# Altium schematic sheet Sheet1.SchDoc (part 1 of 2)
size A2; SheetNumber: 1; SheetTotal: 1
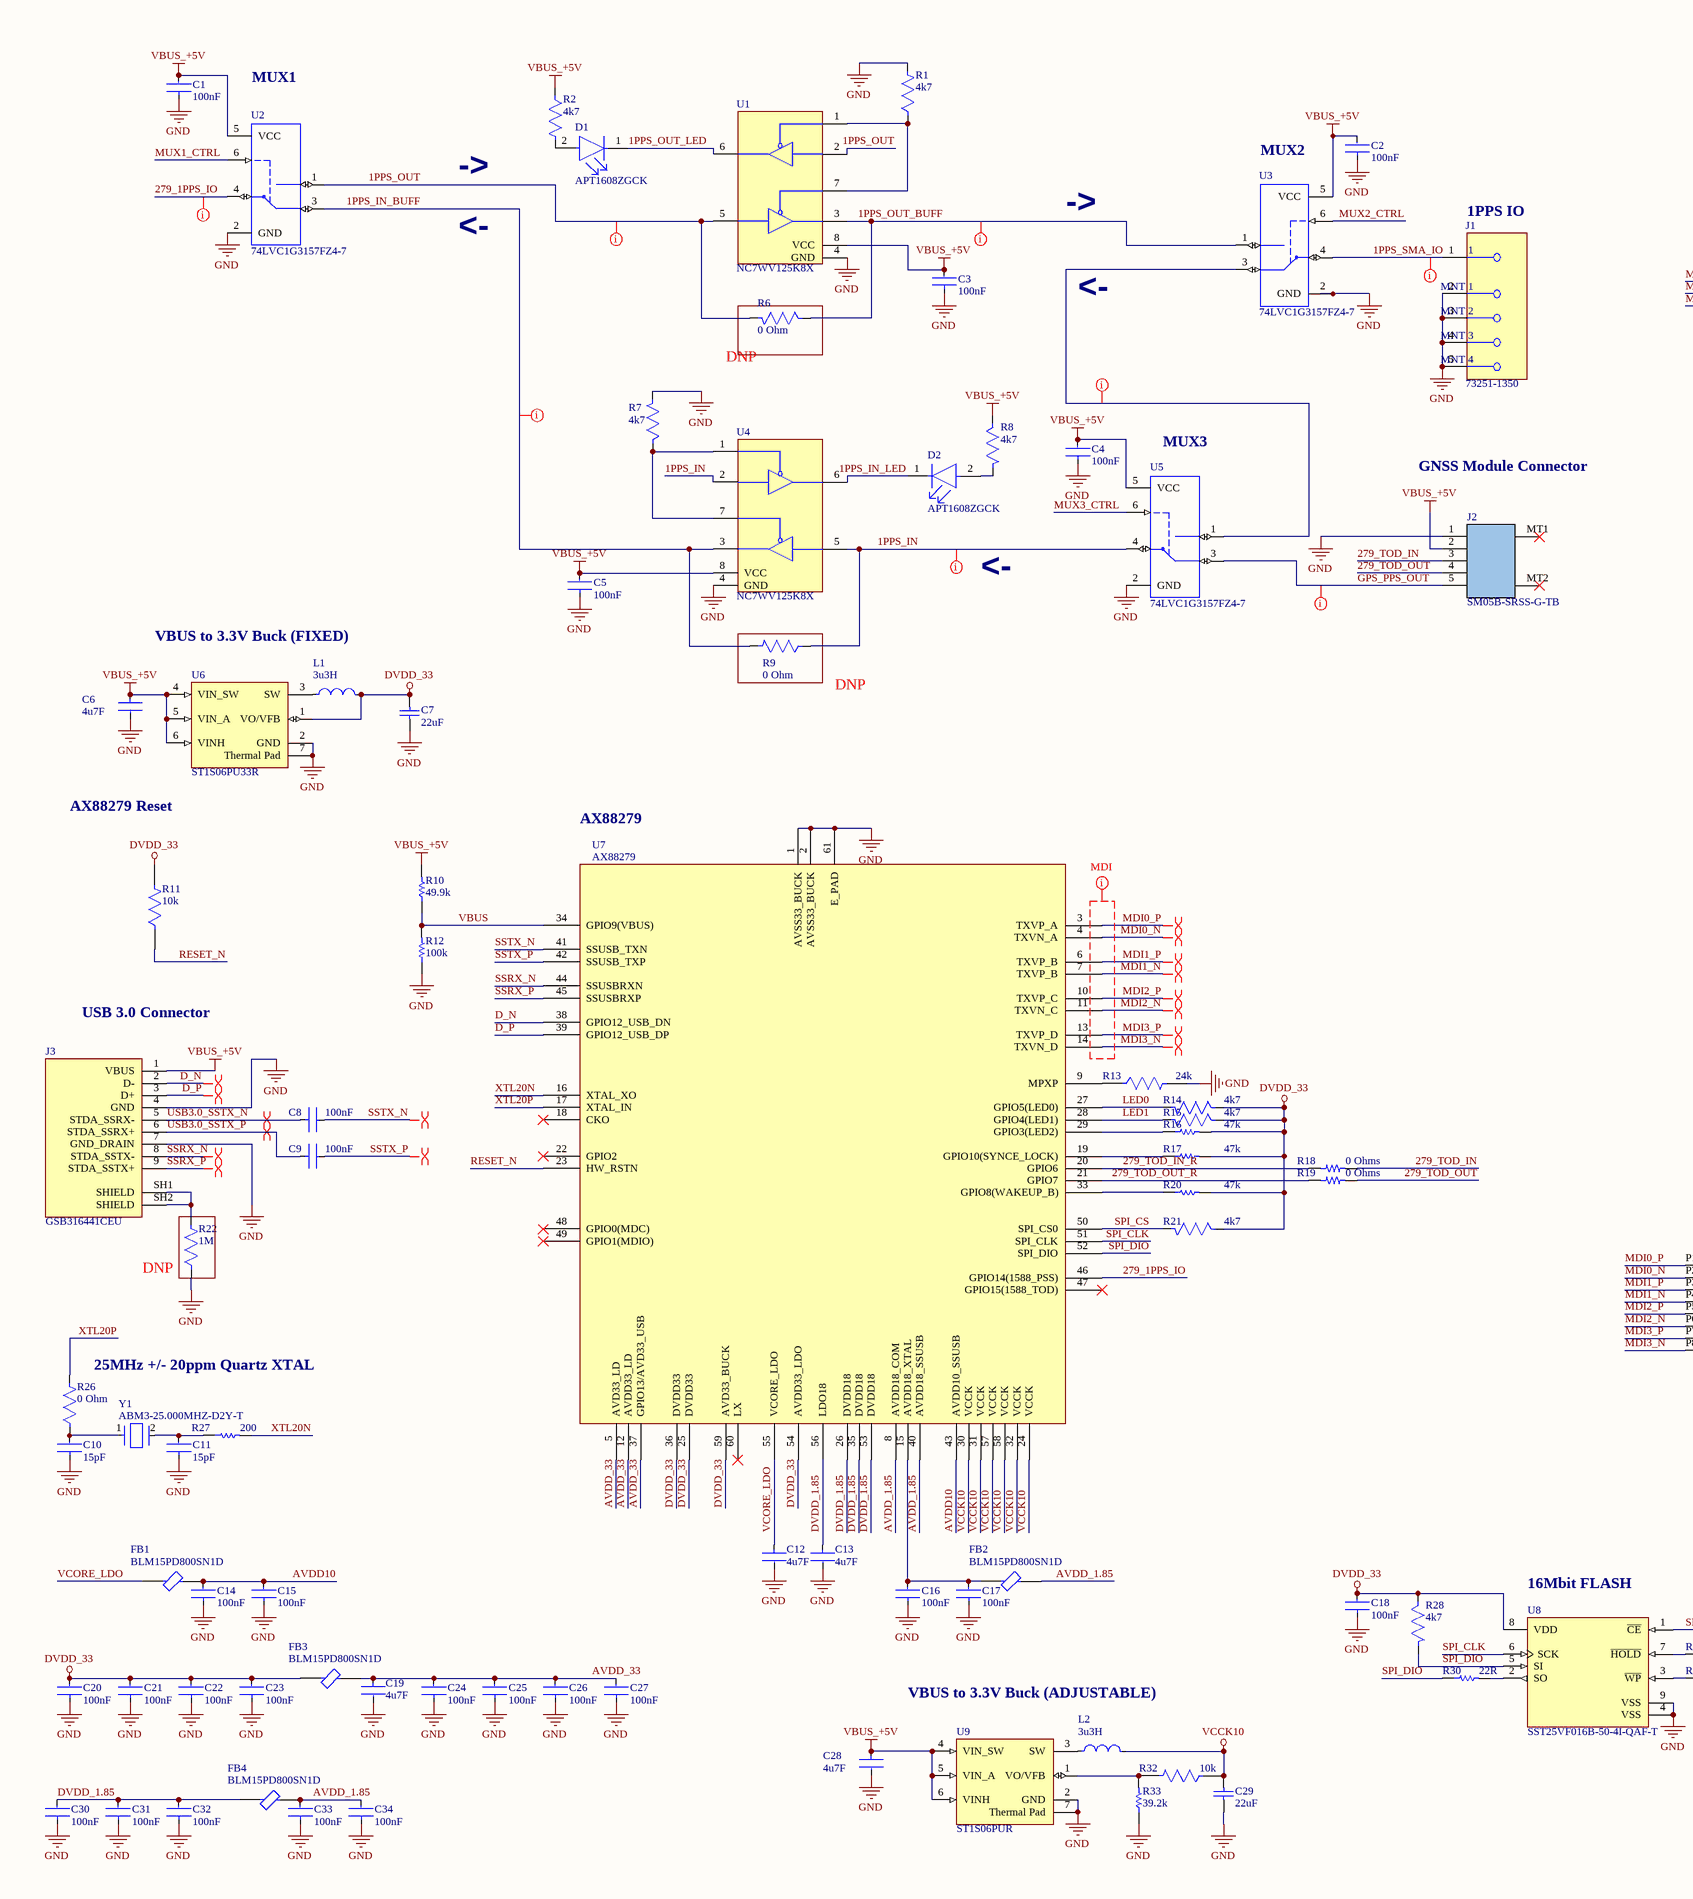
[diagram p0: Sheet1.SchDoc, left]
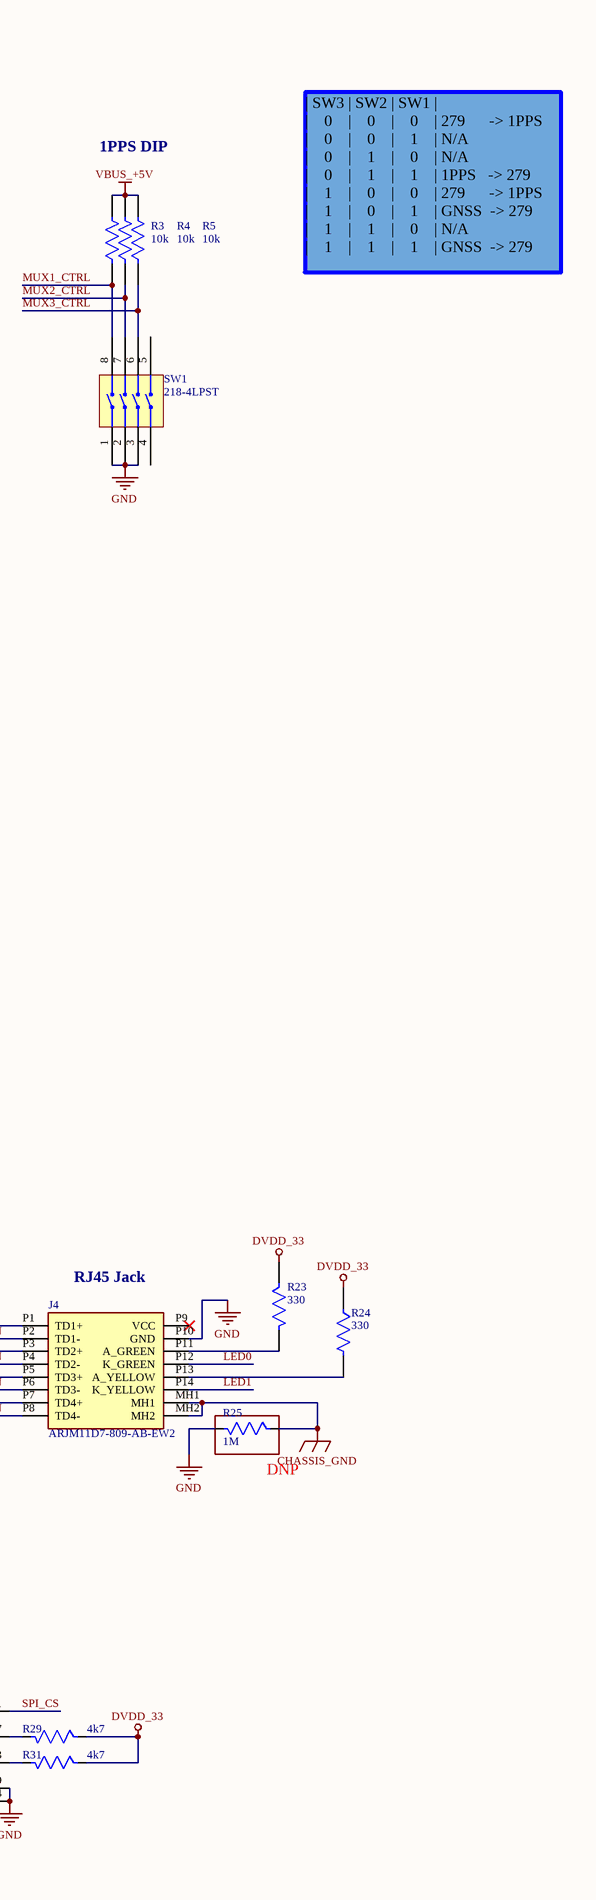
[diagram p1: Sheet1.SchDoc, right]

## Parts
C1  100nF  [FP-CL251-IPC_C]
C2  100nF  [FP-CL251-IPC_C]
C3  100nF  [FP-CL251-IPC_C]
C4  100nF  [FP-CL251-IPC_C]
C5  100nF  [FP-CL251-IPC_C]
C6  4u7F  [FP-0402-L_1_0_0_15-W_0_5-IPC_C]
C7  22uF  [CAPC1608X100X20ML10]
C8  100nF  [FP-CL251-IPC_C]
C9  100nF  [FP-CL251-IPC_C]
C10  15pF  [FP-CBR04C-MFG]
C11  15pF  [FP-CBR04C-MFG]
C12  4u7F  [FP-0402-L_1_0_0_15-W_0_5-IPC_C]
C13  4u7F  [FP-0402-L_1_0_0_15-W_0_5-IPC_C]
C14  100nF  [FP-CL251-IPC_C]
C15  100nF  [FP-CL251-IPC_C]
C16  100nF  [FP-CL251-IPC_C]
C17  100nF  [FP-CL251-IPC_C]
C18  100nF  [FP-CL251-IPC_C]
C19  4u7F  [FP-0402-L_1_0_0_15-W_0_5-IPC_C]
C20  100nF  [FP-CL251-IPC_C]
C21  100nF  [FP-CL251-IPC_C]
C22  100nF  [FP-CL251-IPC_C]
C23  100nF  [FP-CL251-IPC_C]
C24  100nF  [FP-CL251-IPC_C]
C25  100nF  [FP-CL251-IPC_C]
C26  100nF  [FP-CL251-IPC_C]
C27  100nF  [FP-CL251-IPC_C]
C28  4u7F  [FP-0402-L_1_0_0_15-W_0_5-IPC_C]
C29  22uF  [CAPC1608X100X20ML10]
C30  100nF  [FP-CL251-IPC_C]
C31  100nF  [FP-CL251-IPC_C]
C32  100nF  [FP-CL251-IPC_C]
C33  100nF  [FP-CL251-IPC_C]
C34  100nF  [FP-CL251-IPC_C]
D1  APT1608ZGCK  [FP-APT1608ZGCK-MFG]
D2  APT1608ZGCK  [FP-APT1608ZGCK-MFG]
FB1  BLM15PD800SN1D  [FP-BLM15-0_05-MFG]
FB2  BLM15PD800SN1D  [FP-BLM15-0_05-MFG]
FB3  BLM15PD800SN1D  [FP-BLM15-0_05-MFG]
FB4  BLM15PD800SN1D  [FP-BLM15-0_05-MFG]
J1  73251-1350  [FP-73251-1350-MFG]
J2  Manufacturer Part Number: SM05B-SRSS-G-TB  [JST_SM05B-SRSS-TB_REV_NOV_29_2010]  (hidden comment: JST_SM05B-SRSS-G-TB)
J3  GSB316441CEU  [CONN_AMPHENOL_GSB316441CEU]
J4  ARJM11D7-809-AB-EW2  [ARJM11D7809ABEW2]
L1  3u3H  [FP-LQM2HPN_G0-IPC_A]
L2  3u3H  [FP-LQM2HPN_G0-IPC_A]
R1  4k7  [FP-RT0402-MFG]
R2  4k7  [FP-RT0402-MFG]
R3  10k  [FP-RMCF0402-IPC_C]
R4  10k  [FP-RMCF0402-IPC_C]
R5  10k  [FP-RMCF0402-IPC_C]
R6  0 Ohm  [FP-CR0402-IPC_B]  (no BOM)
R7  4k7  [FP-RT0402-MFG]
R8  4k7  [FP-RT0402-MFG]
R9  0 Ohm  [FP-CR0402-IPC_B]  (no BOM)
R10  49.9k  [RESC1005X40X25LL10T10]
R11  10k  [FP-RMCF0402-IPC_C]
R12  100k  [RESC1005X40X25ML05T05]
R13  24k  [FP-RT0402-MFG]
R14  4k7  [FP-RT0402-MFG]
R15  4k7  [FP-RT0402-MFG]
R16  47k  [RESC1005X40X25LL10T10]
R17  47k  [RESC1005X40X25LL10T10]
R18  0 Ohms  [RES 0402_1005]
R19  0 Ohms  [RES 0402_1005]
R20  47k  [RESC1005X40X25LL10T10]
R21  4k7  [FP-RT0402-MFG]
R22  1M  [FP-RMCF0402-MFG]  (no BOM)
R23  330  [FP-RC1005-IPC_B]
R24  330  [FP-RC1005-IPC_B]
R25  1M  [FP-RMCF0402-MFG]  (no BOM)
R26  0 Ohm  [FP-CR0402-IPC_B]
R27  200  [RESC1005X40X25LL10T10]
R28  4k7  [FP-RT0402-MFG]
R29  4k7  [FP-RT0402-MFG]
R30  22R  [RESC1005X40X25ML05T10]
R31  4k7  [FP-RT0402-MFG]
R32  10k  [FP-RMCF0402-IPC_C]
R33  39.2k  [RESC1005X40X25ML05T10]
SW1  218-4LPST  [CTS 218-4LPJ]
U1  NC7WV125K8X  [SOP50P310X90-8N]
U2  74LVC1G3157FZ4-7  [PSON50P140X100X40-6N]
U3  74LVC1G3157FZ4-7  [PSON50P140X100X40-6N]
U4  NC7WV125K8X  [SOP50P310X90-8N]
U5  74LVC1G3157FZ4-7  [PSON50P140X100X40-6N]
U6  ST1S06PU33R  [DFN6D_L]
U7  AX88279  [IC_AX88279]
U8  SST25VF016B-50-4I-QAF-T  [FP-C04-452-MFG]
U9  ST1S06PUR  [DFN6D_M]
Y1  ABM3-25.000MHZ-D2Y-T  [FP-ABM3-MFG]

## Nets
CHASSIS_GND: J4.MH1 J4.MH2 R25.1
DVDD_33: C7.2 C18.2 C20.2 C21.2 C22.2 C23.2 FB3.1 L1.2 R11.2 R14.1 R15.1 R16.2 R17.2 R20.2 R21.1 R23.1 R24.1 R28.1 R29.1 R31.1 U6.1(VO/VFB) U7.25(DVDD33) U7.36(DVDD33) U7.54(AVDD33_LDO) U7.59(AVD33_BUCK) U8.8(VDD)
GND: C1.1 C2.1 C3.1 C4.1 C5.1 C6.1 C7.1 C10.2 C11.2 C12.1 C13.1 C14.1 C15.1 C16.1 C17.1 C18.1 C19.1 C20.1 C21.1 C22.1 C23.1 C24.1 C25.1 C26.1 C27.1 C28.1 C29.1 C30.1 C31.1 C32.1 C33.1 C34.1 J1.2(MNT_1) J1.3(MNT_2) J1.4(MNT_3) J1.5(MNT_4) J2.1 J3.4(GND) J3.7(GND_DRAIN) J4.P10(GND) R1.2 R7.2 R12.1 R13.2 R22.1 R25.2 R33.1 SW1.1(GND) SW1.2(GND) SW1.3(GND) U1.4(GND) U2.2(GND) U3.2(GND) U4.4(GND) U5.2(GND) U6.2(GND) U6.7(Thermal_Pad) U7.1(AVSS33_BUCK) U7.2(AVSS33_BUCK) U7.61(E_PAD) U8.4(VSS) U8.9(VSS) U9.2(GND) U9.7(Thermal_Pad)
VBUS_+5V: C1.2 C2.2 C3.2 C4.2 C5.2 C6.2 C28.2 J2.2 J3.1(VBUS) R2.1 R3.2 R4.2 R5.2 R8.1 R10.2 U1.8(VCC) U2.5(VCC) U3.5(VCC) U4.8(VCC) U5.5(VCC) U6.4(VIN_SW) U6.5(VIN_A) U6.6(VINH) U9.4(VIN_SW) U9.5(VIN_A) U9.6(VINH)
VCCK10: C29.2 L2.2 R32.1 U7.24(VCCK) U7.30(VCCK) U7.31(VCCK) U7.32(VCCK) U7.57(VCCK) U7.58(VCCK)
1PPS_IN: R9.1 U4.2 U4.5 U5.4(A)
1PPS_IN_BUFF: R9.2 U2.3(B0) U4.3
1PPS_IN_LED: D2.1(C) U4.6
1PPS_OUT: R6.2 U1.2 U1.5 U2.1(B1)
1PPS_OUT_BUFF: R6.1 U1.3 U3.1(B1)
1PPS_OUT_LED: D1.1(C) U1.6
1PPS_SMA_IO: J1.1 U3.4(A)
279_1PPS_IO: U2.4(A) U7.46(GPIO14(1588_PSS))
279_TOD_IN: J2.3 R18.2
279_TOD_IN_R: R18.1 U7.20(GPIO6)
279_TOD_OUT: J2.4 R19.2
279_TOD_OUT_R: R19.1 U7.21(GPIO7)
AVDD10: C14.2 C15.2 FB1.2 U7.43(AVDD10_SSUSB)
AVDD_1.85: C33.2 C34.2 FB2.2 FB4.2 U7.8(AVDD18_COM) U7.40(AVDD18_SSUSB)
AVDD_33: C19.2 C24.2 C25.2 C26.2 C27.2 FB3.2 U7.5(AVD33_LD) U7.12(AVDD33_LD) U7.37(GPIO13/AVD33_USB)
D_N: J3.2(D-) U7.38(GPIO12_USB_DN)
D_P: J3.3(D+) U7.39(GPIO12_USB_DP)
DVDD_1.85: C13.2 C30.2 C31.2 C32.2 FB4.1 U7.26(DVDD18) U7.35(DVDD18) U7.53(DVDD18) U7.56(LDO18)
GPS_PPS_OUT: J2.5 U5.3(B0)
LED0: J4.P12(K_GREEN) R14.2 U7.27(GPIO5(LED0))
LED1: J4.P14(K_YELLOW) R15.2 U7.28(GPIO4(LED1))
MDI0_N: J4.P2(TD1-) U7.4(TXVN_A)
MDI0_P: J4.P1(TD1+) U7.3(TXVP_A)
MDI1_N: J4.P4(TD2-) U7.7(TXVP_B)
MDI1_P: J4.P3(TD2+) U7.6(TXVP_B)
MDI2_N: J4.P6(TD3-) U7.11(TXVN_C)
MDI2_P: J4.P5(TD3+) U7.10(TXVP_C)
MDI3_N: J4.P8(TD4-) U7.14(TXVN_D)
MDI3_P: J4.P7(TD4+) U7.13(TXVP_D)
MUX1_CTRL: R3.1 SW1.8 U2.6(S)
MUX2_CTRL: R4.1 SW1.7 U3.6(S)
MUX3_CTRL: R5.1 SW1.6 U5.6(S)
RESET_N: R11.1 U7.23(HW_RSTN)
SPI_CLK: U7.51(SPI_CLK) U8.6(SCK)
SPI_CS: R21.2 U7.50(SPI_CS0) U8.1(~{CE})
SPI_DIO: R28.2 R30.1 U7.52(SPI_DIO) U8.5(SI)
SSRX_N: J3.8(STDA_SSTX-) U7.44(SSUSBRXN)
SSRX_P: J3.9(STDA_SSTX+) U7.45(SSUSBRXP)
SSTX_N: C8.2 U7.41(SSUSB_TXN)
SSTX_P: C9.2 U7.42(SSUSB_TXP)
USB3.0_SSTX_N: C8.1 J3.5(STDA_SSRX-)
USB3.0_SSTX_P: C9.1 J3.6(STDA_SSRX+)
VBUS: R10.1 R12.2 U7.34(GPIO9(VBUS))
VCORE_LDO: C12.2 FB1.1 U7.55(VCORE_LDO)
XTL20N: R27.2 U7.16(XTAL_XO)
XTL20P: R26.2 U7.17(XTAL_IN)
NetC10_1: C10.1 R26.1 Y1.1
NetC11_1: C11.1 R27.1 Y1.2
NetC16_2: C16.2 C17.2 FB2.1 U7.15(AVDD18_XTAL)
NetD1_2: D1.2(A) R2.2
NetD2_2: D2.2(A) R8.2
NetJ3_SH1: J3.SH1(SHIELD) J3.SH2(SHIELD) R22.2
NetJ4_P11: J4.P11(A_GREEN) R23.2
NetJ4_P13: J4.P13(A_YELLOW) R24.2
NetL1_1: L1.1 U6.3(SW)
NetL2_1: L2.1 U9.3(SW)
NetR1_1: R1.1 U1.1 U1.7
NetR7_1: R7.1 U4.1 U4.7
NetR13_1: R13.1 U7.9(MPXP)
NetR16_1: R16.1 U7.29(GPIO3(LED2))
NetR17_1: R17.1 U7.19(GPIO10(SYNCE_LOCK))
NetR20_1: R20.1 U7.33(GPIO8(WAKEUP_B))
NetR29_2: R29.2 U8.7(~{HOLD})
NetR30_2: R30.2 U8.2(SO)
NetR31_2: R31.2 U8.3(~{WP})
NetR32_2: R32.2 R33.2 U9.1(VO/VFB)
NetU3_3: U3.3(B0) U5.1(B1)

Not connected (* = marked no-connect by the designer): J2 MT1* MT2*; J4 P9(VCC)*; SW1 4(GND) 5; U7 18(CKO)* 22(GPIO2)* 47(GPIO15(1588_TOD))* 48(GPIO0(MDC))* 49(GPIO1(MDIO))* 60(LX)*

## Layout directives
differential pair; differential pair class MDI: MDI0_N, MDI0_P, MDI1_N, MDI1_P, MDI2_N, MDI2_P, MDI3_N, MDI3_P
differential pair; differential pair class USB; differential pair class *: D_N
differential pair; differential pair class USB: D_P, SSRX_N, SSRX_P, SSTX_N, SSTX_P, USB3.0_SSTX_N, USB3.0_SSTX_P
net class PPS_50: 1PPS_IN, 1PPS_IN_BUFF, 1PPS_OUT, 1PPS_OUT_BUFF, 1PPS_SMA_IO, 279_1PPS_IO, GPS_PPS_OUT, NetU3_3
net class MDI: (no net found under the mark)

## Notes on the sheet
- MUX1
- (near U3) MUX2
- 1PPS DIP
- ->
- (near J1) 1PPS IO
- <-
- | SW3 | SW2 | SW1 |
  |    0    |    0    |    0    | 279      -> 1PPS
  |    0    |    0    |    1    | N/A
  |    0    |    1    |    0    | N/A
  |    0    |    1    |    1    | 1PPS   -> 279
  |    1    |    0    |    0    | 279      -> 1PPS
  |    1    |    0    |    1    | GNSS  -> 279
  |    1    |    1    |    0    | N/A
  |    1    |    1    |    1    | GNSS  -> 279
- DNP
- (near U5) MUX3
- GNSS Module Connector
- VBUS to 3.3V Buck (FIXED)
- (near R9) DNP
- AX88279 Reset
- (near U7) AX88279
- USB 3.0 Connector
- (near J4) RJ45 Jack
- (near R22) DNP
- (near R26) 25MHz +/- 20ppm Quartz XTAL
- (near R25) DNP
- (near U8) 16Mbit FLASH
- VBUS to 3.3V Buck (ADJUSTABLE)